# Altium schematic sheet PoweSupply.SchDoc: Relay Tester
size A4 portrait; Date: 2018.12.12; Author: Ivan Perehiniak; Address2: Ivan Perehiniak; Address3: iv.perehinik@gmail.com; Revision: 3; SheetNumber: 4; SheetTotal: 6
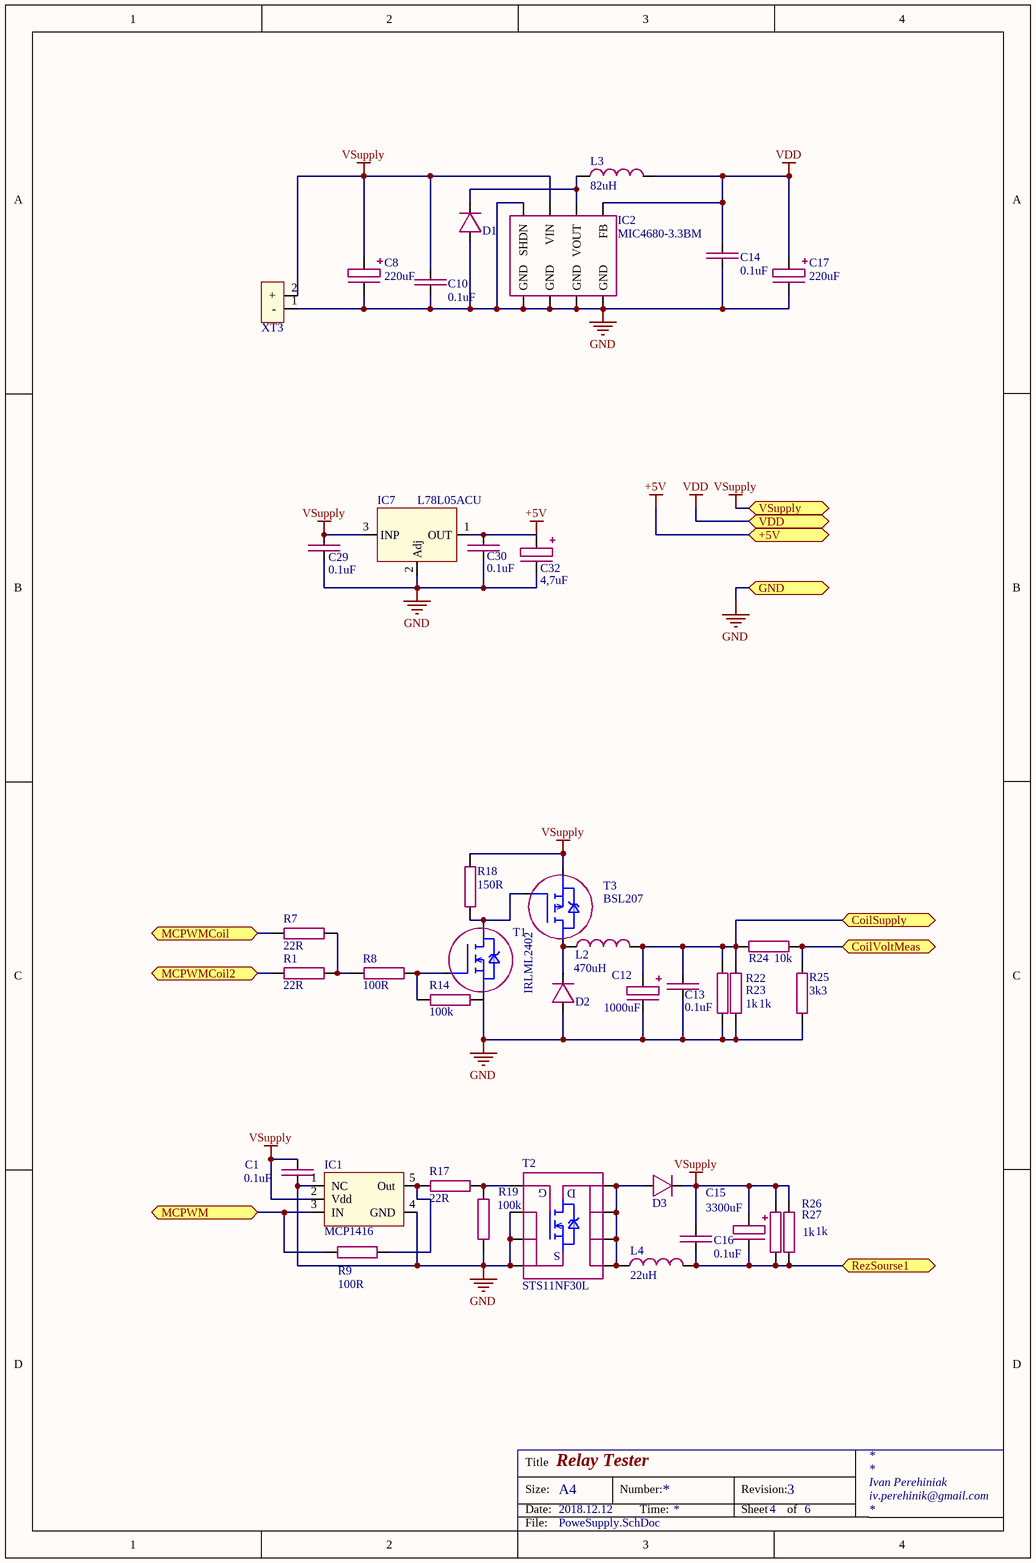
[diagram p0: PoweSupply.SchDoc]

## Parts
C1  0.1uF  [C0603]
C8  220uF  [CAP10x12]
C10  0.1uF  [C0603]
C12  1000uF  [CAP10x12]
C13  0.1uF  [C0603]
C14  0.1uF  [C0603]
C15  3300uF  [CAP12.5x20p]
C16  0.1uF  [C0603]
C17  220uF  [CAP6x11_Hor]
C29  0.1uF  [C0603]
C30  0.1uF  [C0603]
C32  4,7uF  [1206(Tantal A)]
D1  B260A-13-F  [SMA]  (value not drawn)
D2  SK54A-LTP  [SMA]  (value not drawn)
D3  SK54A-LTP  [SMA]  (value not drawn)
IC1  MCP1416  [SOT23-5]
IC2  MIC4680-3.3BM  [SOIC_N]
IC7  L78L05ACU  [SOT89-3]
L2  470uH  [B82477G4]
L3  82uH  [B82477G4]
L4  22uH  [B82477G4]
R1  22R  [R0603]
R7  22R  [R0603]
R8  100R  [R0603]
R9  100R  [R0603]
R14  100k  [R0603]
R17  22R  [R0603]
R18  150R  [Resistor_2W-2]
R19  100k  [R0603]
R22  1k  [R1206]
R23  1k  [R1206]
R24  10k  [R0603]
R25  3k3  [R0603]
R26  1k  [R1206]
R27  1k  [R1206]
T1  IRLML2402  [SOT-23]
T2  STS11NF30L  [SOIC_N]
T3  BSL207  [SOT23-6 - mosfet]
XT3  PowerJack5,5/2,1mm  [PowerJack5.5x2.1]  (value not drawn)

## Ports
+5V, CoilSupply, CoilVoltMeas, GND, MCPWM, MCPWMCoil, MCPWMCoil2, RezSourse1, VDD, VSupply

## Nets
+5V: C30.2 C32.1(+) IC7.1(OUT) ; port +5V
GND: C1.2 C8.2(-) C10.1 C12.2(-) C13.1 C14.1 C17.2(-) C29.1 C30.1 C32.2(-) D1.1(Anode) D2.1(Anode) IC1.1(NC) IC1.4(GND) IC2.1(SHDN) IC2.5(GND) IC2.6(GND) IC2.7(GND) IC2.8(GND) IC7.2(Adj) R14.2 R19.1 R22.1 R23.1 R25.1 T1.2(SOURSE) T2.1(SOURSE) T2.2(SOURSE) T2.3(SOURSE) XT3.1(-) ; port GND
VDD: C14.2 C17.1(+) IC2.4(FB) L3.2 ; port VDD
VSupply: C1.1 C8.1(+) C10.2 C15.1(+) C16.1 C29.2 D3.2(Cathode) IC1.2(Vdd) IC2.2(VIN) IC7.3(INP) R18.2 R26.2 R27.2 T3.3(SOURSE) XT3.2(+) ; port VSupply
CoilSupply: C12.1(+) C13.2 L2.2 R22.2 R23.2 R24.1 ; port CoilSupply
CoilVoltMeas: R24.2 R25.2 ; port CoilVoltMeas
MCPWM: IC1.3(IN) R9.1 ; port MCPWM
MCPWMCoil: R7.1 ; port MCPWMCoil
MCPWMCoil2: R1.2 ; port MCPWMCoil2
RezSourse1: C15.2(-) C16.2 L4.2 R26.1 R27.1 ; port RezSourse1
NetD1_2: D1.2(Cathode) IC2.3(VOUT) L3.1
NetD2_2: D2.2(Cathode) L2.1 T3.2(DRAIN)
NetD3_1: D3.1(Anode) L4.1 T2.5(DRAIN) T2.6(DRAIN) T2.7(DRAIN) T2.8(DRAIN)
NetIC1_5: IC1.5(Out) R9.2 R17.1
NetR1_1: R1.1 R7.2 R8.1
NetR8_2: R8.2 R14.1 T1.1(GATE)
NetR17_2: R17.2 R19.2 T2.4(GATE)
NetR18_1: R18.1 T1.3(DRAIN) T3.1(GATE)

## Notes on the sheet
- Title
- Size:
- Date:
- A4
- Number:
- Time:
- Revision:
- Sheet
- of
- File:
- (in symbol STS11NF30L) G; D; S

## Library data of the parts
C1 C10 C13 C14 C16 C29 C30 = GMK316F475ZG-T: CAP CER 0.1UF 50V X7R 0603; Category: Capacitors; Manufacturer Part Number: GMK316F475ZG-T; Package / Case: 0603 (1608 Metric); ComponentLink1URL: https://search.kemet.com/component-edge/download/datasheet/C0603C104K5RACTU.pdf; ComponentLink1Description: https://search.kemet.com/component-edge/download/datasheet/C0603C104K5RACTU.pdf
C8 = EEU-FC1V221L: CAP ALUM 220UF 20% 35V RADIAL; Category: Capacitors; Manufacturer Part Number: EEU-FC1V221L; Package / Case: Radial, Can
C12 = CE-1000/16PHT-Y: CAP ALUM 1000UF 20% 16V RADIAL; Category: Capacitors; Manufacturer Part Number: CE-1000/16PHT-Y; Package / Case: Radial, Can
C15 = UVR1C332MHD: CAP ALUM 3300UF 20% 16V RADIAL; Category: Capacitors; Manufacturer Part Number: UVR1C332MHD; Package / Case: Radial, Can
C17 = EEUFC1A221SH: CAP ALUM 220UF 20% 10V RADIAL; Category: Capacitors; Manufacturer Part Number: EEUFC1A221SH; Package / Case: Radial, Can
C32 = T491A475K010AT: CAP TANT 4.7UF 10V 10% 1206; Category: Capacitors; Manufacturer Part Number: T491A475K010AT; Package / Case: 1206 (3216 Metric)
D1 = B260A-13-F: DIODE SCHOTTKY 2A 40V SMA; Category: Discrete Semiconductor Products; Manufacturer Part Number: B260A-13-F; Package / Case: DO-214AC, SMA
D2 D3 = SK54A-LTP: DIODE SCHOTTKY 5A 40V SMA; Category: Discrete Semiconductor Products; Manufacturer Part Number: SK54A-LTP; Package / Case: DO-214AC, SMA
IC1 = MCP1416T-E/OT: IC MOSFET DVR 1.5A HS SOT23-5; Category: Integrated Circuits (ICs); Manufacturer Part Number: MCP1416T-E/OT; Package / Case: SC-74A, SOT-753,sot23/5
IC2 = MIC4680-3.3BM: BUCK CONV 3.3V 1A; Category: Discrete Semiconductor Products; Manufacturer Part Number: MIC4680-3.3BM; Package / Case: SOIC8
IC7 = L78L05ACU: IC REG LINEAR 5V 100MA SOT89-3; Manufacturer Part Number: L78L05ACU; Category: Integrated Circuits (ICs); Package / Case: TO-243AA
L2 = DE1207-470: FIXED IND 470UH 1A 741 MOHM SMD; Manufacturer Part Number: DE1207-390; Category: Inductors, Coils, Chokes; Package / Case: Nonstandard(10x10)
L3 = DE1205-82: FIXED IND 82UH 1.2A SMD; Category: Inductors, Coils, Chokes; Manufacturer Part Number: DE1205-82; Package / Case: Nonstandard(12x12)
L4 = DE1209-22: FIXED IND 22UH 5A 39 MOHM SMD; Category: Inductors, Coils, Chokes; Manufacturer Part Number: DE1209-22; Package / Case: Nonstandard(12.6x12.6)
R1 R7 R17 = CRCW060322R0FKEA: RES SMD 22 OHM 1% 1/10W 0603; Category: Resistors; Package / Case: 0603 (1608 Metric); Manufacturer Part Number: CRCW060322R0FKEA
R8 R9 = ERJ-S03J101V: RES SMD 100 OHM 5% 1/10W 0603; Category: Resistors; Package / Case: 0603 (1608 Metric); Manufacturer Part Number: ERJ-S03J101V; ComponentLink1URL: https://industrial.panasonic.com/cdbs/www-data/pdf/RDA0000/AOA0000C304.pdf; ComponentLink1Description: https://industrial.panasonic.com/cdbs/www-data/pdf/RDA0000/AOA0000C304.pdf; ComponentLink2URL: http://industrial.panasonic.com/www-cgi/jvcr13pz.cgi?E+PZ+3+AOA0005+ERJS03J101V+7+WW; ComponentLink2Description: http://industrial.panasonic.com/www-cgi/jvcr13pz.cgi?E+PZ+3+AOA0005+ERJS03J101V+7+WW
R14 R19 = ERJ-S03J104V: RES SMD 100K OHM 5% 1/10W 0603; Category: Resistors; Package / Case: 0603 (1608 Metric); Manufacturer Part Number: ERJ-S03J104V; ComponentLink1URL: https://industrial.panasonic.com/cdbs/www-data/pdf/RDA0000/AOA0000C304.pdf; ComponentLink1Description: https://industrial.panasonic.com/cdbs/www-data/pdf/RDA0000/AOA0000C304.pdf; ComponentLink2URL: http://industrial.panasonic.com/www-cgi/jvcr13pz.cgi?E+PZ+3+AOA0005+ERJS03J101V+7+WW; ComponentLink2Description: http://industrial.panasonic.com/www-cgi/jvcr13pz.cgi?E+PZ+3+AOA0005+ERJS03J101V+7+WW; ComponentLink3URL: https://industrial.panasonic.com/cdbs/www-data/pdf/RDO0000/AOA0000C331.pdf; ComponentLink3Description: https://industrial.panasonic.com/cdbs/www-data/pdf/RDO0000/AOA0000C331.pdf
R18 = 2WT-150OHM: RES THT 150 OHM 5% 2W; Category: Resistors; Manufacturer Part Number: 2WT-150OHM
R22 R23 R26 R27 = ERJ-8GEYJ102V: RES SMD 1K OHM 5% 1/4W 1206; Category: Resistors; Package / Case: 1206 (3216 Metric); Manufacturer Part Number: ERJ-8GEYJ102V; ComponentLink1URL: https://industrial.panasonic.com/cdbs/www-data/pdf/RDA0000/AOA0000C304.pdf; ComponentLink1Description: https://industrial.panasonic.com/cdbs/www-data/pdf/RDA0000/AOA0000C304.pdf; ComponentLink2URL: http://industrial.panasonic.com/www-cgi/jvcr13pz.cgi?E+PZ+3+AOA0005+ERJS03J101V+7+WW; ComponentLink2Description: http://industrial.panasonic.com/www-cgi/jvcr13pz.cgi?E+PZ+3+AOA0005+ERJS03J101V+7+WW
R24 = CRCW060310K0FKTABC: RES SMD 10K OHM 1% 1/10W 0603; Category: Resistors; Package / Case: 0603 (1608 Metric); Manufacturer Part Number: CRCW060310K0FKTABC
R25 = CRCW06033K30FKTABC: RES SMD 3.3K OHM 1% 1/10W 0603; Category: Resistors; Package / Case: 0603 (1608 Metric); Manufacturer Part Number: CRCW06033K30FKTABC
T1 = IRLML2402TRPBF: MOSFET N-CH 20V 1.2A SOT-23; Category: Discrete Semiconductor Products; Manufacturer Part Number: IRLML2402TRPBF; Package / Case: TO-236-3, SC-59, SOT-23-3
T2 = STS11NF30L: MOSFET N-CH 30V 11A 8-SOIC; Category: Discrete Semiconductor Products; Manufacturer Part Number: STS11NF30L; Package / Case: SOT-23-6
T3 = BSL207SPH6327XTSA1: MOSFET P-CH 20V 6A 6TSOP; Category: Discrete Semiconductor Products; Manufacturer Part Number: BSL207SPH6327XTSA1; Package / Case: SOT-23-6 Thin, TSOT-23-6
XT3 = PowerJack5,5/2,1mm: SIL VERTICAL PC TAIL PIN HEADER; Manufacturer Part Number: FC68148; Category: Connectors, Interconnects